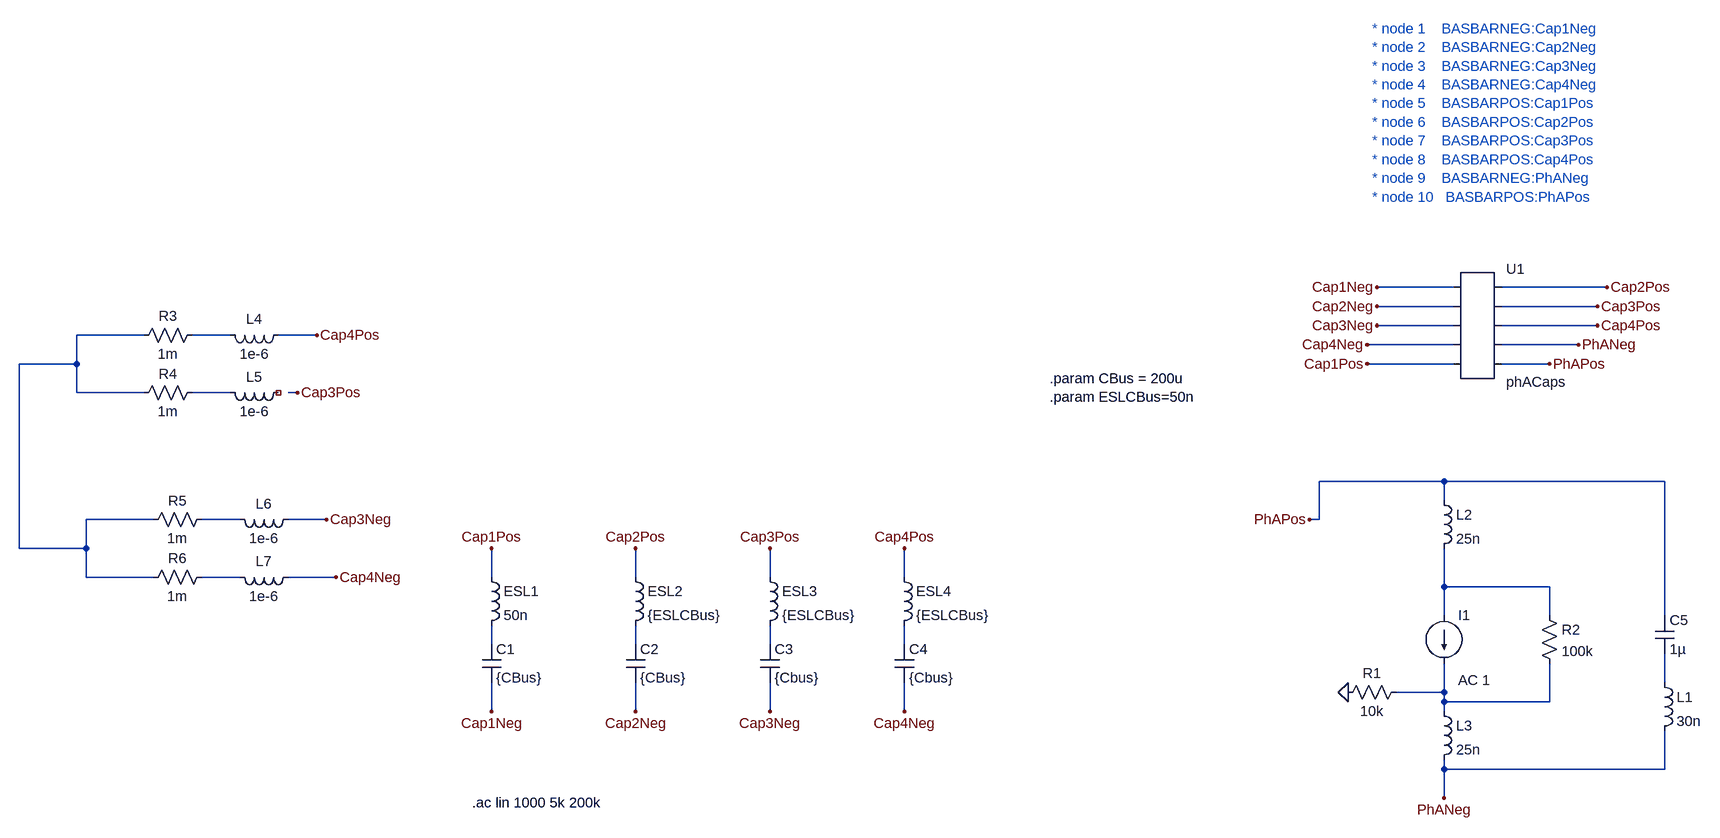
[diagram p0: schematic PhAResponseBattert.asc]
PhAResponseBattert.asc, the LTspice schematic file:
Version 4
SHEET 1 1828 2192
WIRE 384 -192 256 -192
WIRE 640 -192 464 -192
WIRE 384 -160 256 -160
WIRE 624 -160 464 -160
WIRE 384 -128 256 -128
WIRE 624 -128 464 -128
WIRE -2352 -112 -2464 -112
WIRE -2208 -112 -2272 -112
WIRE -2064 -112 -2128 -112
WIRE 384 -96 240 -96
WIRE 592 -96 464 -96
WIRE -2464 -64 -2464 -112
WIRE -2464 -64 -2560 -64
WIRE 384 -64 240 -64
WIRE 544 -64 464 -64
WIRE -2464 -16 -2464 -64
WIRE -2352 -16 -2464 -16
WIRE -2208 -16 -2272 -16
WIRE -2096 -16 -2112 -16
WIRE 368 320 160 320
WIRE 736 320 368 320
WIRE 368 352 368 320
WIRE -2336 384 -2448 384
WIRE -2192 384 -2256 384
WIRE -2048 384 -2112 384
WIRE 160 384 160 320
WIRE 160 384 144 384
WIRE -2560 432 -2560 -64
WIRE -2448 432 -2448 384
WIRE -2448 432 -2560 432
WIRE -2448 480 -2448 432
WIRE -2336 480 -2448 480
WIRE -2192 480 -2256 480
WIRE -2032 480 -2112 480
WIRE -1616 480 -1616 432
WIRE -1376 480 -1376 432
WIRE -1152 480 -1152 432
WIRE -928 480 -928 432
WIRE 368 496 368 432
WIRE 544 496 368 496
WIRE 368 544 368 496
WIRE 544 544 544 496
WIRE 736 544 736 320
WIRE -1616 592 -1616 560
WIRE -1376 592 -1376 560
WIRE -1152 592 -1152 560
WIRE -928 592 -928 560
WIRE 736 656 736 608
WIRE 368 672 368 624
WIRE 368 672 288 672
WIRE 368 688 368 672
WIRE 544 688 544 624
WIRE 544 688 368 688
WIRE -1616 704 -1616 656
WIRE -1376 704 -1376 656
WIRE -1152 704 -1152 656
WIRE -928 704 -928 656
WIRE 368 704 368 688
WIRE 368 800 368 784
WIRE 736 800 736 736
WIRE 736 800 368 800
WIRE 368 848 368 800
FLAG -1616 432 Cap1Pos
FLAG -1376 432 Cap2Pos
FLAG -1152 432 Cap3Pos
FLAG -928 432 Cap4Pos
FLAG -1616 704 Cap1Neg
FLAG -1376 704 Cap2Neg
FLAG -1152 704 Cap3Neg
FLAG -928 704 Cap4Neg
FLAG 368 848 PhANeg
FLAG 544 -64 PhAPos
FLAG 592 -96 PhANeg
FLAG 240 -64 Cap1Pos
FLAG 640 -192 Cap2Pos
FLAG 624 -160 Cap3Pos
FLAG 624 -128 Cap4Pos
FLAG 240 -96 Cap4Neg
FLAG 256 -128 Cap3Neg
FLAG 256 -160 Cap2Neg
FLAG 256 -192 Cap1Neg
FLAG 208 672 0
FLAG 144 384 PhAPos
FLAG -2064 -112 Cap4Pos
FLAG -2096 -16 Cap3Pos
FLAG -2048 384 Cap3Neg
FLAG -2032 480 Cap4Neg
SYMBOL cap -1632 592 R0
SYMATTR InstName C1
SYMATTR Value {CBus}
SYMATTR SpiceLine Rser=2m
SYMBOL ind -1632 464 R0
SYMATTR InstName ESL1
SYMATTR Value 50n
SYMBOL cap -1392 592 R0
SYMATTR InstName C2
SYMATTR Value {CBus}
SYMATTR SpiceLine Rser=2m
SYMBOL ind -1392 464 R0
SYMATTR InstName ESL2
SYMATTR Value {ESLCBus}
SYMBOL cap -1168 592 R0
SYMATTR InstName C3
SYMATTR Value {Cbus}
SYMATTR SpiceLine Rser=2m
SYMBOL ind -1168 464 R0
SYMATTR InstName ESL3
SYMATTR Value {ESLCBus}
SYMBOL cap -944 592 R0
SYMATTR InstName C4
SYMATTR Value {Cbus}
SYMATTR SpiceLine Rser=2m
SYMBOL ind -944 464 R0
SYMATTR InstName ESL4
SYMATTR Value {ESLCBus}
SYMBOL current 368 544 R0
WINDOW 123 24 108 Left 2
WINDOW 39 0 0 Left 0
SYMATTR Value2 AC 1
SYMATTR InstName I1
SYMATTR Value ""
SYMBOL res 304 656 R90
WINDOW 0 0 56 VBottom 2
WINDOW 3 32 56 VTop 2
SYMATTR InstName R1
SYMATTR Value 10k
SYMBOL res 528 528 R0
SYMATTR InstName R2
SYMATTR Value 100k
SYMBOL cap 720 544 R0
SYMATTR InstName C5
SYMATTR Value 1µ
SYMBOL ind 720 640 R0
SYMATTR InstName L1
SYMATTR Value 30n
SYMBOL ind 352 336 R0
SYMATTR InstName L2
SYMATTR Value 25n
SYMBOL ind 352 688 R0
SYMATTR InstName L3
SYMATTR Value 25n
SYMBOL ind -2112 -128 R90
WINDOW 0 5 56 VBottom 2
WINDOW 3 32 56 VTop 2
SYMATTR InstName L4
SYMATTR Value 1e-6
SYMBOL ind -2112 -32 R90
WINDOW 0 5 56 VBottom 2
WINDOW 3 32 56 VTop 2
SYMATTR InstName L5
SYMATTR Value 1e-6
SYMBOL res -2256 -128 R90
WINDOW 0 0 56 VBottom 2
WINDOW 3 32 56 VTop 2
SYMATTR InstName R3
SYMATTR Value 1m
SYMBOL res -2256 -32 R90
WINDOW 0 0 56 VBottom 2
WINDOW 3 32 56 VTop 2
SYMATTR InstName R4
SYMATTR Value 1m
SYMBOL ind -2096 368 R90
WINDOW 0 5 56 VBottom 2
WINDOW 3 32 56 VTop 2
SYMATTR InstName L6
SYMATTR Value 1e-6
SYMBOL ind -2096 464 R90
WINDOW 0 5 56 VBottom 2
WINDOW 3 32 56 VTop 2
SYMATTR InstName L7
SYMATTR Value 1e-6
SYMBOL res -2240 368 R90
WINDOW 0 0 56 VBottom 2
WINDOW 3 32 56 VTop 2
SYMATTR InstName R5
SYMATTR Value 1m
SYMBOL res -2240 464 R90
WINDOW 0 0 56 VBottom 2
WINDOW 3 32 56 VTop 2
SYMATTR InstName R6
SYMATTR Value 1m
SYMBOL AutoGenerated\\phACaps 416 -128 R0
SYMATTR InstName U1
TEXT -496 -40 Left 2 !.param CBus = 200u\n.param ESLCBus=50n
TEXT 248 -640 Left 2 ;* node 1    BASBARNEG:Cap1Neg\n* node 2    BASBARNEG:Cap2Neg\n* node 3    BASBARNEG:Cap3Neg\n* node 4    BASBARNEG:Cap4Neg\n* node 5    BASBARPOS:Cap1Pos\n* node 6    BASBARPOS:Cap2Pos\n* node 7    BASBARPOS:Cap3Pos\n* node 8    BASBARPOS:Cap4Pos\n* node 9    BASBARNEG:PhANeg\n* node 10   BASBARPOS:PhAPos
TEXT -1648 856 Left 2 !.ac lin 1000 5k 200k

The netlist it stands for:
* PhAResponseBattert.asc
C1 N007 Cap1Neg {CBus} Rser=2m
L§ESL1 Cap1Pos N007 50n
C2 N008 Cap2Neg {CBus} Rser=2m
L§ESL2 Cap2Pos N008 {ESLCBus}
C3 N009 Cap3Neg {Cbus} Rser=2m
L§ESL3 Cap3Pos N009 {ESLCBus}
C4 N010 Cap4Neg {Cbus} Rser=2m
L§ESL4 Cap4Pos N010 {ESLCBus}
I1 N006 N012 AC 1
R1 N012 0 10k
R2 N006 N012 100k
C5 PhAPos N011 1µ
L1 N011 PhANeg 30n
L2 PhAPos N006 25n
L3 N012 PhANeg 25n
L4 Cap4Pos N002 1e-6
L5 NC_01 N003 1e-6
R3 N002 N001 1m
R4 N003 N001 1m
L6 Cap3Neg N004 1e-6
L7 Cap4Neg N005 1e-6
R5 N004 N001 1m
R6 N005 N001 1m
* U1: phACaps (symbol AutoGenerated\phACaps not available, pins judged from their places): pin1=Cap1Neg pin2=Cap2Neg pin3=Cap3Neg pin4=Cap4Neg pin5=Cap1Pos pin6=Cap2Pos pin7=Cap3Pos pin8=Cap4Pos pin9=PhANeg pin10=PhAPos
.param CBus = 200u
.param ESLCBus=50n
* * node 1    BASBARNEG:Cap1Neg
* * node 2    BASBARNEG:Cap2Neg
* * node 3    BASBARNEG:Cap3Neg
* * node 4    BASBARNEG:Cap4Neg
* * node 5    BASBARPOS:Cap1Pos
* * node 6    BASBARPOS:Cap2Pos
* * node 7    BASBARPOS:Cap3Pos
* * node 8    BASBARPOS:Cap4Pos
* * node 9    BASBARNEG:PhANeg
* * node 10   BASBARPOS:PhAPos
.ac lin 1000 5k 200k
.backanno
.end